# Altium project mod_duo_dwarf.PrjPcb (part 1 of 2)
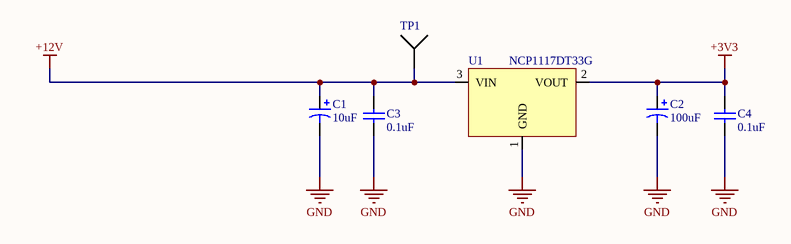
[diagram p0: [1]-PWR_12VIN.SchDoc]
6 sheets, 179 parts. Net scope: flat (ports and power ports of the same name join across sheets).
Board file: mod_duo_dwarf.PcbDoc
Sheets:
  [1]-PWR_12VIN.SchDoc
  [2]-MCU_LPC1778FBD144.SchDoc
  [3]-GLCD_128X64.SchDoc
  [4]-MECH_BUTTONS.SchDoc
  [5]-BUTTONS_ILLUMINATION.SchDoc
  [6]-PEAKMETER_LEDS.SchDoc

## Sheet [1]-PWR_12VIN.SchDoc: [1]-PWR_12VIN
size A3; DocumentNumber: 1; Revision: 01-01-2020; SheetNumber: 1; SheetTotal: 6

### Parts
C1  10uF  [CAP_EEE_C-L]
C2  100uF  [CAPAE6553X55M]
C3  0.1uF  [CAPC1608N]
C4  0.1uF  [CAPC1608N]
TP1  TP_1_MM  [TP_1_MM]  (value not drawn)  (no BOM)
U1  NCP1117DT33G  [DPAK-L]

### Nets
+3V3: C2.1 C4.2 U1.2(VOUT)
+12V: C1.2 C3.2 TP1.1 U1.3(VIN)
GND: C1.1 C2.2 C3.1 C4.1 U1.1(GND)

### Library data of the parts
C1 = EEE-1EA100SR: CAP ALUM 10UF 20% 25V SMD; Manufacturer 1: Panasonic; Ripple Current: 28mA; Life (Hours): 2000Hour; Leakage Current: 3uA; Lead Length: 2.2mm; Supplier 1: Digi-Key; Manufacturer Part Number 1: EEE-1EA100SR; Stock 1: 6724; Pricing 1: 1=0.31, 10=0.214, 100=0.1286, 500=0.09646 (USD); Mount: PCB,Surface Mount; Case/Package: Radial; Number of Pins: 2; Contact Plating: Tin; Min Operating Temperature: -40°C; Max Operating Temperature: 85°C; Capacitance: 10uF; Tolerance: 20%; Packaging: Tape and Reel; Voltage Rating: 25V; Ripple Current (AC): 28mA; Voltage Rating (DC): 25V; Package Quantity: 1; Termination: SMD/SMT; Voltage: 25V; Diameter: 5mm; Length: 5.5mm; Height: 5.4mm; Height - Seated (Max): 0.213inch; Width: 5.3mm; Lead Pitch: 1.5mm; Radiation Hardening: No; REACH SVHC: No SVHC; Supplier Part Number 1: PCE3894CT-ND
C2 = EEE-1AA101WR: CAP ALUM 100UF 20% 10V SMD; Manufacturer 1: Panasonic ECG; Description 1: Cap Aluminum Lytic 100uF 10V 20% (5 X 5.4mm) SMD 50mA 1000h 85C Automotive T/R; Ripple Current: 50mA; Life (Hours): 1000Hour; Supplier 1: Digi-Key; Manufacturer Part Number 1: EEE-1AA101WR; Stock 1: 122621; Pricing 1: 1=0.31, 10=0.212, 100=0.1272, 500=0.0954 (USD); Mount: Surface Mount,PCB; Case/Package: Radial; Contact Plating: Tin; Min Operating Temperature: -40°C; Max Operating Temperature: 85°C; Capacitance: 100uF; Tolerance: 20%; Voltage Rating: 10V; Packaging: Tape and Reel; Package Quantity: 1; Voltage Rating (DC): 10V; Termination: SMD/SMT; Ripple Current (AC): 50mA; Diameter: 5mm; Length: 5.5mm; Height: 5.4mm; Height - Seated (Max): 0.213inch; Radiation Hardening: No; Lead Free: Lead Free; REACH SVHC: Unknown; ComponentLink1URL: https://datasheet.ciiva.com/26945/getdatasheetpartid-169213-26945071.pdf; ComponentLink1Description: https://datasheet.ciiva.com/26945/getdatasheetpartid-169213-26945071.pdf; ComponentLink2URL: https://datasheet.ciiva.com/2983/aba0000ce2-2983906.pdf; ComponentLink2Description: https://datasheet.ciiva.com/2983/aba0000ce2-2983906.pdf; ComponentLink3URL: https://datasheet.ciiva.com/24027/aba0000ce2-40801-24027541.pdf; ComponentLink3Description: https://datasheet.ciiva.com/24027/aba0000ce2-40801-24027541.pdf; ComponentLink4URL: https://datasheet.ciiva.com/30075/11aba0000ce2-30075303.pdf; ComponentLink4Description: https://datasheet.ciiva.com/30075/11aba0000ce2-30075303.pdf; ComponentLink5URL: https://datasheet.ciiva.com/16427/aba0000ce2-16427544.pdf; ComponentLink5Description: https://datasheet.ciiva.com/16427/aba0000ce2-16427544.pdf; ComponentLink6URL: https://datasheet.ciiva.com/14598/70255710-14598233.pdf; ComponentLink6Description: https://datasheet.ciiva.com/14598/70255710-14598233.pdf; ComponentLink7URL: https://datasheet.ciiva.com/14605/70255710-14605689.pdf; ComponentLink7Description: https://datasheet.ciiva.com/14605/70255710-14605689.pdf; ComponentLink8URL: https://datasheet.ciiva.com/11673/aba0000ce2-11673882.pdf; ComponentLink8Description: https://datasheet.ciiva.com/11673/aba0000ce2-11673882.pdf; Supplier Part Number 1: PCE3867CT-ND
C3 C4 = CC0603KRX7R8BB104: CAP CER 0.1UF 25V X7R 0603; Manufacturer 1: Yageo; Capacitance: 100nF; Tolerance: 10%; Supplier 1: Digi-Key; Manufacturer Part Number 1: CC0603KRX7R8BB104; Stock 1: 40000; Pricing 1: 1=0.1, 10=0.074, 100=0.0329, 500=0.02352, 1000=0.01848 (USD); Mount: Surface Mount; Case/Package: 0603; Number of Pins: 2; Case Code (Imperial): 0603; Case Code (Metric): 1608; Min Operating Temperature: -55°C; Max Operating Temperature: 125°C; Dielectric: X7R; Voltage Rating: 25V; Packaging: Tape and Reel; Package Quantity: 1; Voltage Rating (DC): 25V; Termination: SMD/SMT; Composition: Ceramic; Voltage: 25V; Length: 1.6mm; Height: 0.8mm; Width: 0.8mm; Thickness: 0.035inch; Depth: 0.8mm; Radiation Hardening: No; REACH SVHC: Unknown; Lead Free: Lead Free; Halogen Free: Halogen Free; ComponentLink1URL: https://datasheet.ciiva.com/11786/0900766b80c10176-11786120.pdf; ComponentLink1Description: https://datasheet.ciiva.com/11786/0900766b80c10176-11786120.pdf; ComponentLink2URL: https://datasheet.ciiva.com/144/mlccorderingcode-144075.pdf; ComponentLink2Description: https://datasheet.ciiva.com/144/mlccorderingcode-144075.pdf; ComponentLink3URL: https://datasheet.ciiva.com/17434/upy-gphc-x7r-6-3v-to-50v-8-17434263.pdf; ComponentLink3Description: https://datasheet.ciiva.com/17434/upy-gphc-x7r-6-3v-to-50v-8-17434263.pdf; ComponentLink4URL: https://datasheet.ciiva.com/26829/getdatasheetpartid-403577-26829431.pdf; ComponentLink4Description: https://datasheet.ciiva.com/26829/getdatasheetpartid-403577-26829431.pdf; ComponentLink5URL: https://datasheet.ciiva.com/11587/upy-gphc-x7r-6-3v-to-50v-8-11587208.pdf; ComponentLink5Description: https://datasheet.ciiva.com/11587/upy-gphc-x7r-6-3v-to-50v-8-11587208.pdf; ComponentLink6URL: https://datasheet.ciiva.com/13389/upy-gphc-x7r-6-3v-to-50v-8-13389352.pdf; ComponentLink6Description: https://datasheet.ciiva.com/13389/upy-gphc-x7r-6-3v-to-50v-8-13389352.pdf; ComponentLink7URL: https://datasheet.ciiva.com/28450/1489800-28450584.pdf; ComponentLink7Description: https://datasheet.ciiva.com/28450/1489800-28450584.pdf; ComponentLink8URL: https://datasheet.ciiva.com/144/mlccorderingcode-144073.pdf; ComponentLink8Description: https://datasheet.ciiva.com/144/mlccorderingcode-144073.pdf; ComponentLink9URL: https://datasheet.ciiva.com/144/mlccorderingcode-144074.pdf; ComponentLink9Description: https://datasheet.ciiva.com/144/mlccorderingcode-144074.pdf; ComponentLink10URL: https://datasheet.ciiva.com/7978/1489800-7978155.pdf; ComponentLink10Description: https://datasheet.ciiva.com/7978/1489800-7978155.pdf; Supplier Part Number 1: 311-1341-1-ND
U1 = IC_NCP1117DT33G: IC REG LDO 3.3V 1A DPAK; Manufacturer 1: ON Semiconductor; Dropout Voltage: 1.07V; Max Input Voltage: 20V; Number of Outputs: 1; Input Bias Current: 6mA; Polarity: Positive; Accuracy: 1%; Output Type: Fixed; Supplier 1: Digi-Key; Manufacturer Part Number 1: NCP1117DT33G; Stock 1: 3065; Pricing 1: 1=0.44, 75=0.3504, 150=0.28027, 525=0.22023, 1050=0.17017 (USD); Mount: Surface Mount; Case/Package: DPAK; Number of Pins: 3; Contact Plating: Matte,Tin; Min Operating Temperature: 0°C; Max Operating Temperature: 125°C; Output Current: 1A; Max Output Current: 1A; Output Voltage: 3.3V; Package Quantity: 75; Packaging: Rail/Tube; Nominal Output Voltage: 3.3V; Number of Regulators: 1; Min Current Limit: 1A; Quiescent Current: 6mA; Min Output Voltage: 3.3V; Output Voltage Accuracy: 1%; Length: 6.73mm; Height: 2.38mm; Width: 6.22mm; Radiation Hardening: No; REACH SVHC: No SVHC; Lead Free: Lead Free; Halogen Free: Halogen Free; Supplier Part Number 1: NCP1117DT33GOS-ND

## Sheet [2]-MCU_LPC1778FBD144.SchDoc: [2]-MCU_LPC1778FBD144
size A2; DocumentNumber: 2; Revision: 01-01-2020; SheetNumber: 2; SheetTotal: 6
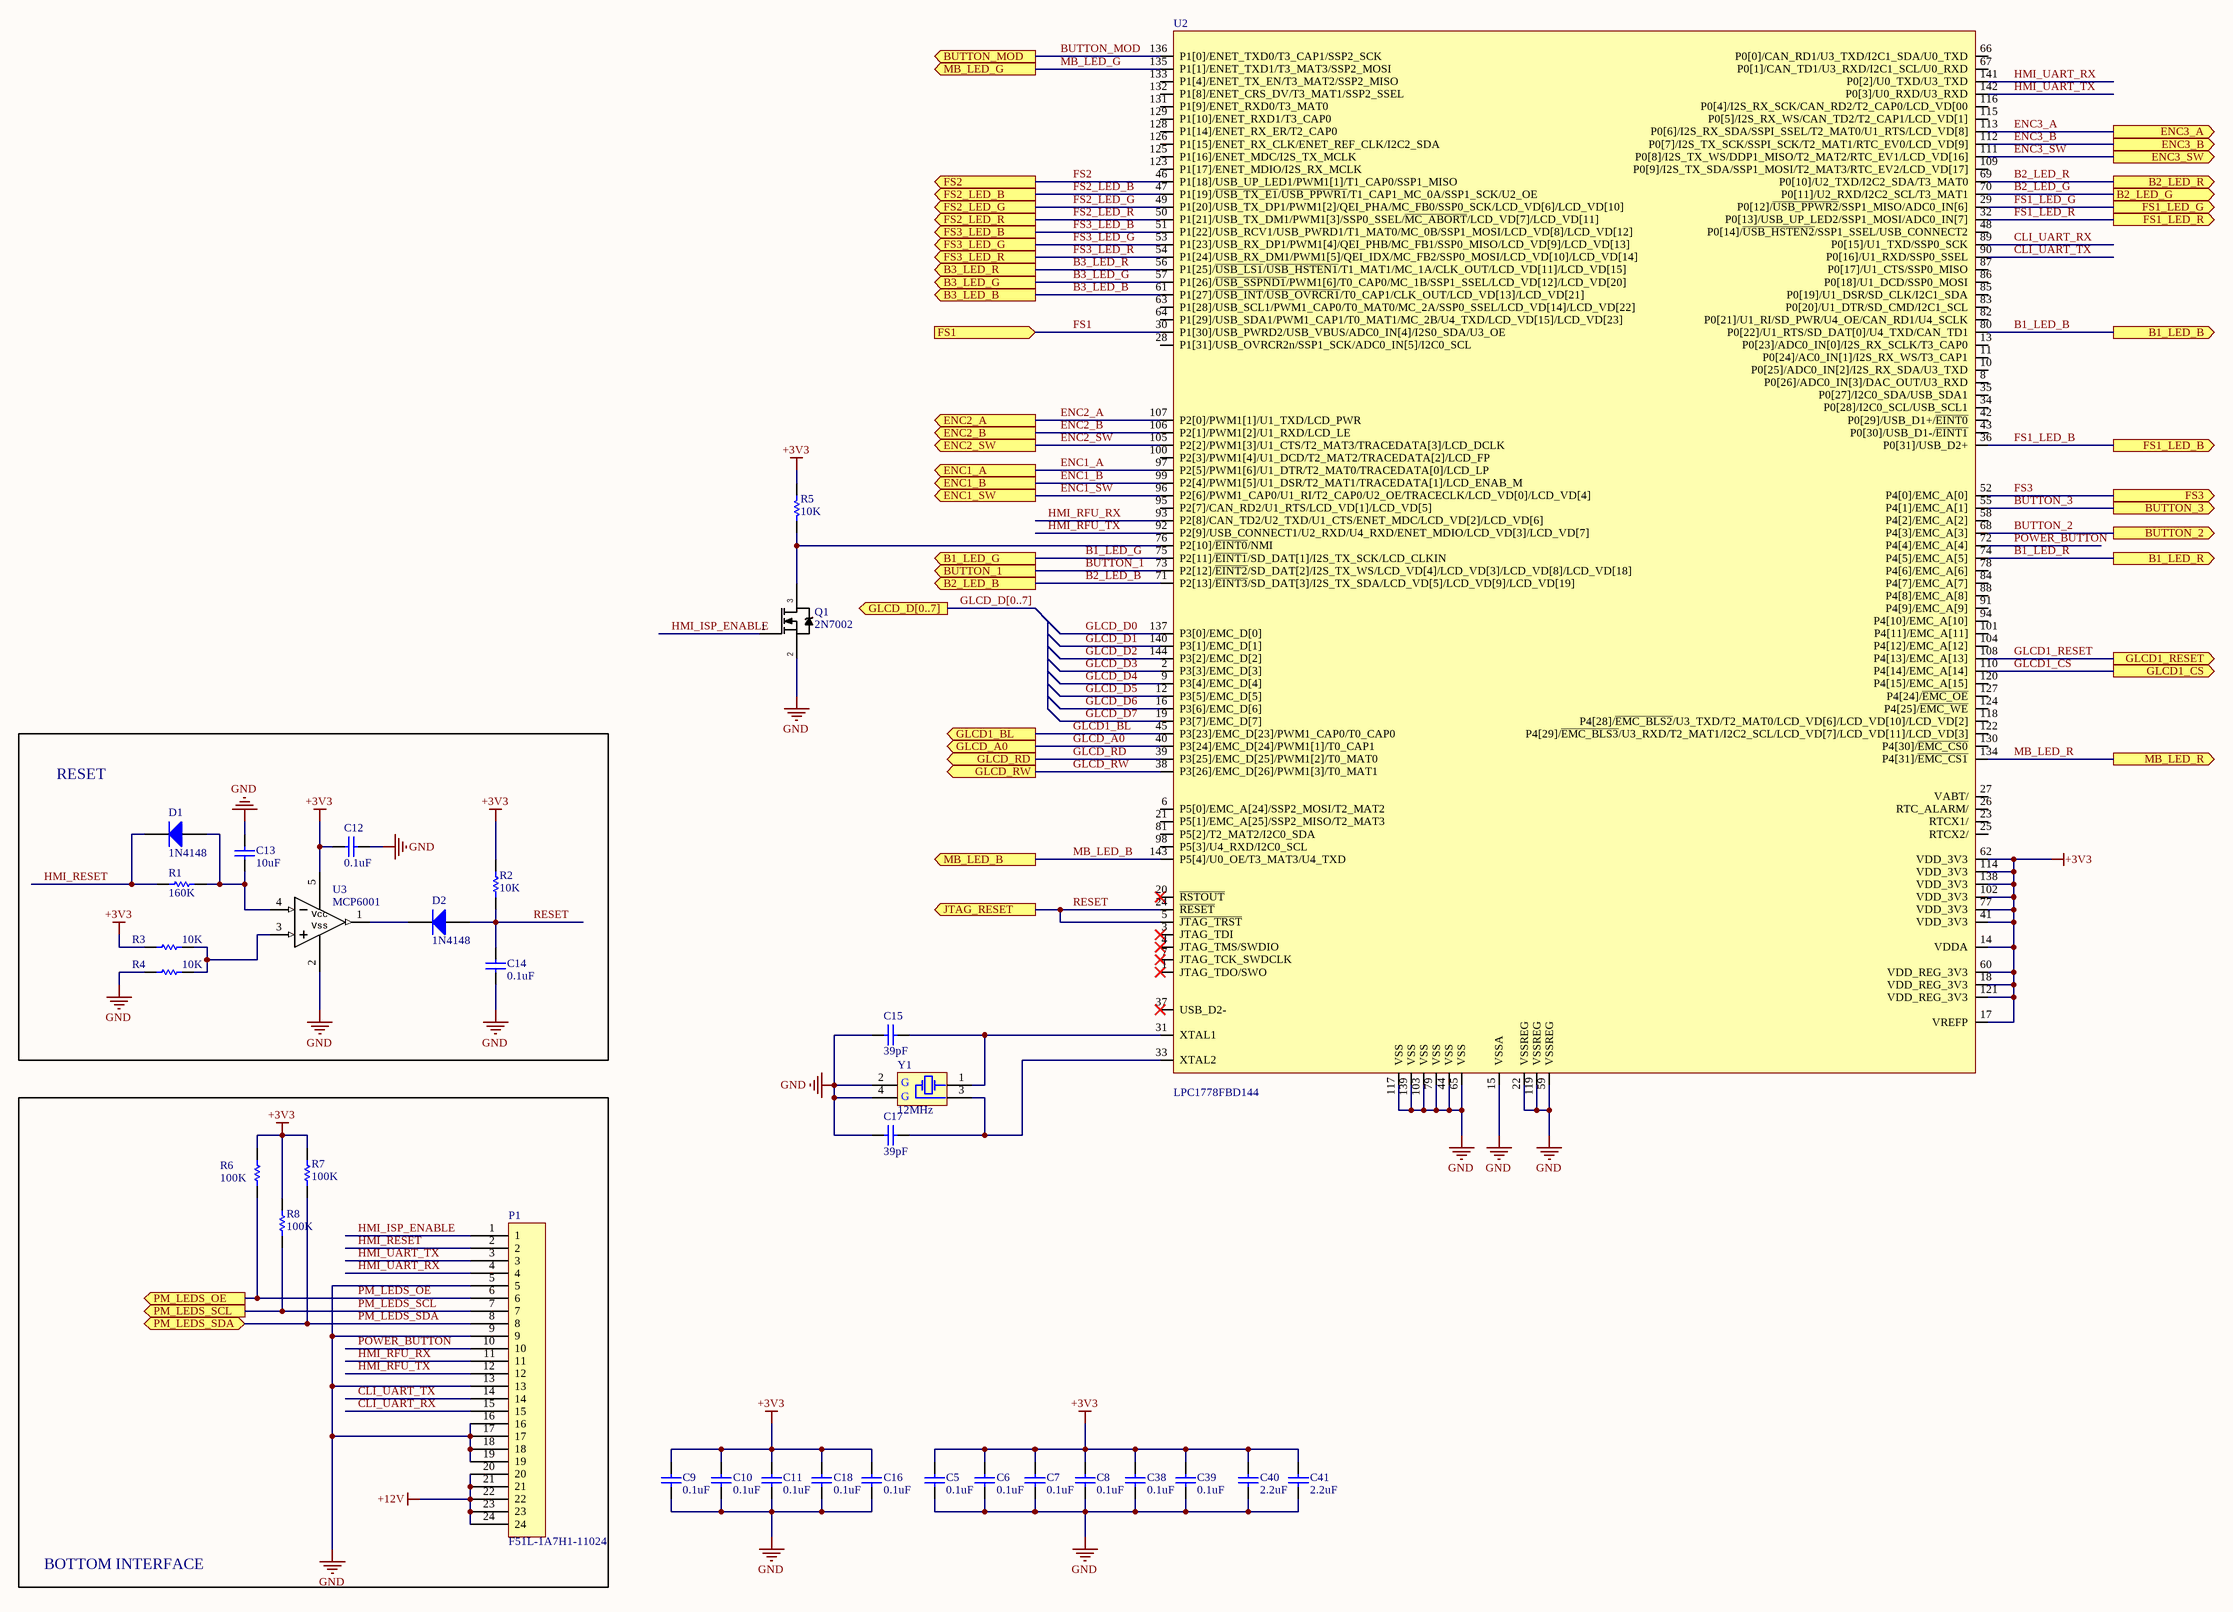
[diagram p1: [2]-MCU_LPC1778FBD144.SchDoc]

### Parts
C5  0.1uF  [CAPC1608N]
C6  0.1uF  [CAPC1608N]
C7  0.1uF  [CAPC1608N]
C8  0.1uF  [CAPC1608N]
C9  0.1uF  [CAPC1608N]
C10  0.1uF  [CAPC1608N]
C11  0.1uF  [CAPC1608N]
C12  0.1uF  [CAPC1608N]
C13  10uF  [CAPC1608N]
C14  0.1uF  [CAPC1608N]
C15  39pF  [CAPC1608N]
C16  0.1uF  [CAPC1608N]
C17  39pF  [CAPC1608N]
C18  0.1uF  [CAPC1608N]
C38  0.1uF  [CAPC1608N]
C39  0.1uF  [CAPC1608N]
C40  2.2uF  [CAPC1608N]
C41  2.2uF  [CAPC1608N]
D1  1N4148  [SOD-323]
D2  1N4148  [SOD-323]
P1  F51L-1A7H1-11024  [F51L-1A7H1-11024]
Q1  2N7002  [SOT23-3N]
R1  160K  [RESC1608N]
R2  10K  [RESC1608N]
R3  10K  [RESC1608N]
R4  10K  [RESC1608N]
R5  10K  [RESC1608N]
R6  100K  [RESC1608N]
R7  100K  [RESC1608N]
R8  100K  [RESC1608N]
U2  LPC1778FBD144  [LQFP144-SOT486-1]
U3  MCP6001  [SOT23-5N]
Y1  12MHz  [ECS-120-20-30B-AGL-TR]

### Blocks framed on the sheet
RESET: C12-C14 D1 D2 R1-R4 U3
BOTTOM INTERFACE: P1 R6-R8

### Ports
B1_LED_B (out), B1_LED_G (out), B1_LED_R (out), B2_LED_B (out), B2_LED_G (out), B2_LED_R (out), B3_LED_B (out), B3_LED_G (out), B3_LED_R (out), BUTTON_1 (out), BUTTON_2 (out), BUTTON_3 (out), BUTTON_MOD (out), ENC1_A (out), ENC1_B (out), ENC1_SW (out), ENC2_A (out), ENC2_B (out), ENC2_SW (out), ENC3_A (out), ENC3_B (out), ENC3_SW (out), FS1 (in), FS1_LED_B (out), FS1_LED_G (out), FS1_LED_R (out), FS2 (out), FS2_LED_B (out), FS2_LED_G (out), FS2_LED_R (out), FS3 (out), FS3_LED_B (out), FS3_LED_G (out), FS3_LED_R (out), GLCD1_BL (out), GLCD1_CS (out), GLCD1_RESET (out), GLCD_A0 (out), GLCD_D[0..7] (out), GLCD_RD (out), GLCD_RW (out), JTAG_RESET (out), MB_LED_B (out), MB_LED_G (out), MB_LED_R (out), PM_LEDS_OE (out), PM_LEDS_SCL (out), PM_LEDS_SDA (bidir)

### Nets
+3V3: C5.2 C6.2 C7.2 C8.2 C9.2 C10.2 C11.2 C12.2 C16.2 C18.2 C38.2 C39.2 C40.2 C41.2 R2.1 R3.2 R5.1 R6.2 R7.2 R8.2 U2.14(VDDA) U2.17(VREFP) U2.18(VDD_REG_3V3) U2.41(VDD_3V3) U2.60(VDD_REG_3V3) U2.62(VDD_3V3) U2.77(VDD_3V3) U2.102(VDD_3V3) U2.114(VDD_3V3) U2.121(VDD_REG_3V3) U2.138(VDD_3V3) U3.5(VCC)
+12V: P1.20 P1.21 P1.22 P1.23 P1.24
GND: C5.1 C6.1 C7.1 C8.1 C9.1 C10.1 C11.1 C12.1 C13.1 C14.2 C15.2 C16.1 C17.1 C18.1 C38.1 C39.1 C40.1 C41.1 P1.5 P1.9 P1.13 P1.16 P1.17 P1.18 P1.19 Q1.2(S) R4.2 U2.15(VSSA) U2.22(VSSREG) U2.44(VSS) U2.59(VSSREG) U2.65(VSS) U2.79(VSS) U2.103(VSS) U2.117(VSS) U2.119(VSSREG) U2.139(VSS) U3.2(VSS) Y1.2(G) Y1.4(G)
B1_LED_B: U2.80(P0[22]/U1_RTS/SD_DAT[0]/U4_TXD/CAN_TD1) ; port B1_LED_B
B1_LED_G: U2.75(P2[11]/~{EINT1}/SD_DAT[1]/I2S_TX_SCK/LCD_CLKIN) ; port B1_LED_G
B1_LED_R: U2.74(P4[5]/EMC_A[5]) ; port B1_LED_R
B2_LED_B: U2.71(P2[13]/~{EINT3}/SD_DAT[3]/I2S_TX_SDA/LCD_VD[5]/LCD_VD[9]/LCD_VD[19]) ; port B2_LED_B
B2_LED_G: U2.70(P0[11]/U2_RXD/I2C2_SCL/T3_MAT1) ; port B2_LED_G
B2_LED_R: U2.69(P0[10]/U2_TXD/I2C2_SDA/T3_MAT0) ; port B2_LED_R
B3_LED_B: U2.61(P1[27]/~{USB_INT}/~{USB_OVRCR1}/T0_CAP1/CLK_OUT/LCD_VD[13]/LCD_VD[21]) ; port B3_LED_B
B3_LED_G: U2.57(P1[26]/~{USB_SSPND1}/PWM1[6]/T0_CAP0/MC_1B/SSP1_SSEL/LCD_VD[12]/LCD_VD[20]) ; port B3_LED_G
B3_LED_R: U2.56(P1[25]/~{USB_LS1}/~{USB_HSTEN1}/T1_MAT1/MC_1A/CLK_OUT/LCD_VD[11]/LCD_VD[15]) ; port B3_LED_R
BUTTON_1: U2.73(P2[12]/~{EINT2}/SD_DAT[2]/I2S_TX_WS/LCD_VD[4]/LCD_VD[3]/LCD_VD[8]/LCD_VD[18]) ; port BUTTON_1
BUTTON_2: U2.68(P4[3]/EMC_A[3]) ; port BUTTON_2
BUTTON_3: U2.55(P4[1]/EMC_A[1]) ; port BUTTON_3
BUTTON_MOD: U2.136(P1[0]/ENET_TXD0/T3_CAP1/SSP2_SCK) ; port BUTTON_MOD
CLI_UART_RX: P1.15 U2.89(P0[15]/U1_TXD/SSP0_SCK)
CLI_UART_TX: P1.14 U2.90(P0[16]/U1_RXD/SSP0_SSEL)
ENC1_A: U2.97(P2[5]/PWM1[6]/U1_DTR/T2_MAT0/TRACEDATA[0]/LCD_LP) ; port ENC1_A
ENC1_B: U2.99(P2[4]/PWM1[5]/U1_DSR/T2_MAT1/TRACEDATA[1]/LCD_ENAB_M) ; port ENC1_B
ENC1_SW: U2.96(P2[6]/PWM1_CAP0/U1_RI/T2_CAP0/U2_OE/TRACECLK/LCD_VD[0]/LCD_VD[4]) ; port ENC1_SW
ENC2_A: U2.107(P2[0]/PWM1[1]/U1_TXD/LCD_PWR) ; port ENC2_A
ENC2_B: U2.106(P2[1]/PWM1[2]/U1_RXD/LCD_LE) ; port ENC2_B
ENC2_SW: U2.105(P2[2]/PWM1[3]/U1_CTS/T2_MAT3/TRACEDATA[3]/LCD_DCLK) ; port ENC2_SW
ENC3_A: U2.113(P0[6]/I2S_RX_SDA/SSPI_SSEL/T2_MAT0/U1_RTS/LCD_VD[8]) ; port ENC3_A
ENC3_B: U2.112(P0[7]/I2S_TX_SCK/SSPI_SCK/T2_MAT1/RTC_EV0/LCD_VD[9]) ; port ENC3_B
ENC3_SW: U2.111(P0[8]/I2S_TX_WS/DDP1_MISO/T2_MAT2/RTC_EV1/LCD_VD[16]) ; port ENC3_SW
FS1: U2.30(P1[30]/USB_PWRD2/USB_VBUS/ADC0_IN[4]/I2S0_SDA/U3_OE) ; port FS1
FS1_LED_B: U2.36(P0[31]/USB_D2+) ; port FS1_LED_B
FS1_LED_G: U2.29(P0[12]/~{USB_PPWR2}/SSP1_MISO/ADC0_IN[6]) ; port FS1_LED_G
FS1_LED_R: U2.32(P0[13]/USB_UP_LED2/SSP1_MOSI/ADC0_IN[7]) ; port FS1_LED_R
FS2: U2.46(P1[18]/USB_UP_LED1/PWM1[1]/T1_CAP0/SSP1_MISO) ; port FS2
FS2_LED_B: U2.47(P1[19]/~{USB_TX_E1}/~{USB_PPWR1}/T1_CAP1_MC_0A/SSP1_SCK/U2_OE) ; port FS2_LED_B
FS2_LED_G: U2.49(P1[20]/USB_TX_DP1/PWM1[2]/QEI_PHA/MC_FB0/SSP0_SCK/LCD_VD[6]/LCD_VD[10]) ; port FS2_LED_G
FS2_LED_R: U2.50(P1[21]/USB_TX_DM1/PWM1[3]/SSP0_SSEL/~{MC_ABORT}/LCD_VD[7]/LCD_VD[11]) ; port FS2_LED_R
FS3: U2.52(P4[0]/EMC_A[0]) ; port FS3
FS3_LED_B: U2.51(P1[22]/USB_RCV1/USB_PWRD1/T1_MAT0/MC_0B/SSP1_MOSI/LCD_VD[8]/LCD_VD[12]) ; port FS3_LED_B
FS3_LED_G: U2.53(P1[23]/USB_RX_DP1/PWM1[4]/QEI_PHB/MC_FB1/SSP0_MISO/LCD_VD[9]/LCD_VD[13]) ; port FS3_LED_G
FS3_LED_R: U2.54(P1[24]/USB_RX_DM1/PWM1[5]/QEI_IDX/MC_FB2/SSP0_MOSI/LCD_VD[10]/LCD_VD[14]) ; port FS3_LED_R
GLCD1_BL: U2.45(P3[23]/EMC_D[23]/PWM1_CAP0/T0_CAP0) ; port GLCD1_BL
GLCD1_CS: U2.110(P4[14]/EMC_A[14]) ; port GLCD1_CS
GLCD1_RESET: U2.108(P4[13]/EMC_A[13]) ; port GLCD1_RESET
GLCD_A0: U2.40(P3[24]/EMC_D[24]/PWM1[1]/T0_CAP1) ; port GLCD_A0
GLCD_D0: U2.137(P3[0]/EMC_D[0])
GLCD_D1: U2.140(P3[1]/EMC_D[1])
GLCD_D2: U2.144(P3[2]/EMC_D[2])
GLCD_D3: U2.2(P3[3]/EMC_D[3])
GLCD_D4: U2.9(P3[4]/EMC_D[4])
GLCD_D5: U2.12(P3[5]/EMC_D[5])
GLCD_D6: U2.16(P3[6]/EMC_D[6])
GLCD_D7: U2.19(P3[7]/EMC_D[7])
GLCD_RD: U2.39(P3[25]/EMC_D[25]/PWM1[2]/T0_MAT0) ; port GLCD_RD
GLCD_RW: U2.38(P3[26]/EMC_D[26]/PWM1[3]/T0_MAT1) ; port GLCD_RW
HMI_ISP_ENABLE: P1.1 Q1.1(G)
HMI_RESET: D1.1(K) P1.2 R1.1
HMI_RFU_RX: P1.11 U2.93(P2[8]/CAN_TD2/U2_TXD/U1_CTS/ENET_MDC/LCD_VD[2]/LCD_VD[6])
HMI_RFU_TX: P1.12 U2.92(P2[9]/USB_CONNECT1/U2_RXD/U4_RXD/ENET_MDIO/LCD_VD[3]/LCD_VD[7])
HMI_UART_RX: P1.4 U2.141(P0[2]/U0_TXD/U3_TXD)
HMI_UART_TX: P1.3 U2.142(P0[3]/U0_RXD/U3_RXD)
MB_LED_B: U2.143(P5[4]/U0_OE/T3_MAT3/U4_TXD) ; port MB_LED_B
MB_LED_G: U2.135(P1[1]/ENET_TXD1/T3_MAT3/SSP2_MOSI) ; port MB_LED_G
MB_LED_R: U2.134(P4[31]/~{EMC_CS1}) ; port MB_LED_R
PM_LEDS_OE: P1.6 R6.1 ; port PM_LEDS_OE
PM_LEDS_SCL: P1.7 R8.1 ; port PM_LEDS_SCL
PM_LEDS_SDA: P1.8 R7.1 ; port PM_LEDS_SDA
POWER_BUTTON: P1.10 U2.72(P4[4]/EMC_A[4])
RESET: C14.1 D2.2(A) R2.2 U2.5(~{JTAG_TRST}) U2.24(~{RESET}) ; port JTAG_RESET
NetC13_2: C13.2 D1.2(A) R1.2 U3.4(IN-)
NetC15_1: C15.1 U2.31(XTAL1) Y1.1(OSC1)
NetC17_2: C17.2 U2.33(XTAL2) Y1.3(OSC2)
NetD2_1: D2.1(K) U3.1(OUT)
NetQ1_3: Q1.3(D) R5.2 U2.76(P2[10]/~{EINT0}/NMI)
NetR3_1: R3.1 R4.1 U3.3(IN+)

Not connected (* = marked no-connect by the designer): U2 1(JTAG_TDO/SWO)* 3(JTAG_TDI)* 4(JTAG_TMS/SWDIO)* 6(P5[0]/EMC_A[24]/SSP2_MOSI/T2_MAT2) 7(JTAG_TCK_SWDCLK)* 8(P0[26]/ADC0_IN[3]/DAC_OUT/U3_RXD) 10(P0[25]/ADC0_IN[2]/I2S_RX_SDA/U3_TXD) 11(P0[24]/AC0_IN[1]/I2S_RX_WS/T3_CAP1) 13(P0[23]/ADC0_IN[0]/I2S_RX_SCLK/T3_CAP0) 20(~{RSTOUT})* 21(P5[1]/EMC_A[25]/SSP2_MISO/T2_MAT3) 23(RTCX1/) 25(RTCX2/) 26(RTC_ALARM/) 27(VABT/) 28(P1[31]/USB_OVRCR2n/SSP1_SCK/ADC0_IN[5]/I2C0_SCL) 34(P0[28]/I2C0_SCL/USB_SCL1) 35(P0[27]/I2C0_SDA/USB_SDA1) 37(USB_D2-)* 42(P0[29]/USB_D1+/~{EINT0}) 43(P0[30]/USB_D1-/~{EINT1}) 48(P0[14]/~{USB_HSTEN2}/SSP1_SSEL/USB_CONNECT2) 58(P4[2]/EMC_A[2]) 63(P1[28]/USB_SCL1/PWM1_CAP0/T0_MAT0/MC_2A/SSP0_SSEL/LCD_VD[14]/LCD_VD[22]) 64(P1[29]/USB_SDA1/PWM1_CAP1/T0_MAT1/MC_2B/U4_TXD/LCD_VD[15]/LCD_VD[23]) 66(P0[0]/CAN_RD1/U3_TXD/I2C1_SDA/U0_TXD) 67(P0[1]/CAN_TD1/U3_RXD/I2C1_SCL/U0_RXD) 78(P4[6]/EMC_A[6]) 81(P5[2]/T2_MAT2/I2C0_SDA) 82(P0[21]/U1_RI/SD_PWR/U4_OE/CAN_RD1/U4_SCLK) 83(P0[20]/U1_DTR/SD_CMD/I2C1_SCL) 84(P4[7]/EMC_A[7]) 85(P0[19]/U1_DSR/SD_CLK/I2C1_SDA) 86(P0[18]/U1_DCD/SSP0_MOSI) 87(P0[17]/U1_CTS/SSP0_MISO) 88(P4[8]/EMC_A[8]) 91(P4[9]/EMC_A[9]) 94(P4[10]/EMC_A[10]) 95(P2[7]/CAN_RD2/U1_RTS/LCD_VD[1]/LCD_VD[5]) 98(P5[3]/U4_RXD/I2C0_SCL) 100(P2[3]/PWM1[4]/U1_DCD/T2_MAT2/TRACEDATA[2]/LCD_FP) 101(P4[11]/EMC_A[11]) 104(P4[12]/EMC_A[12]) 109(P0[9]/I2S_TX_SDA/SSP1_MOSI/T2_MAT3/RTC_EV2/LCD_VD[17]) 115(P0[5]/I2S_RX_WS/CAN_TD2/T2_CAP1/LCD_VD[1]) 116(P0[4]/I2S_RX_SCK/CAN_RD2/T2_CAP0/LCD_VD[00) 118(P4[28]/~{EMC_BLS2}/U3_TXD/T2_MAT0/LCD_VD[6]/LCD_VD[10]/LCD_VD[2]) 120(P4[15]/EMC_A[15]) 122(P4[29]/~{EMC_BLS3}/U3_RXD/T2_MAT1/I2C2_SCL/LCD_VD[7]/LCD_VD[11]/LCD_VD[3]) 123(P1[17]/ENET_MDIO/I2S_RX_MCLK) 124(P4[25]/~{EMC_WE}) 125(P1[16]/ENET_MDC/I2S_TX_MCLK) 126(P1[15]/ENET_RX_CLK/ENET_REF_CLK/I2C2_SDA) 127(P4[24]/~{EMC_OE}) 128(P1[14]/ENET_RX_ER/T2_CAP0) 129(P1[10]/ENET_RXD1/T3_CAP0) 130(P4[30]/~{EMC_CS0}) 131(P1[9]/ENET_RXD0/T3_MAT0) 132(P1[8]/ENET_CRS_DV/T3_MAT1/SSP2_SSEL) 133(P1[4]/ENET_TX_EN/T3_MAT2/SSP2_MISO)

### Buses and harness runs
bus GLCD_D[0..7] = port GLCD_D[0..7]

### Notes on the sheet
- (in symbol IC_MCP6001T-I/OT) Vcc; Vss

### Library data of the parts
C5-C12 C14 C16 C18 C38 C39 = CC0603KRX7R8BB104: as C3 on sheet [1]-PWR_12VIN; Supplier 1: Digi-Key; Manufacturer Part Number 1: CC0603KRX7R8BB104; Stock 1: 40000; Pricing 1: 1=0.1, 10=0.074, 100=0.0329, 500=0.02352, 1000=0.01848 (USD); Mount: Surface Mount; Case/Package: 0603; Number of Pins: 2; Case Code (Imperial): 0603; Case Code (Metric): 1608; Min Operating Temperature: -55°C; Max Operating Temperature: 125°C; Dielectric: X7R; Voltage Rating: 25V; Packaging: Tape and Reel; Package Quantity: 1; Voltage Rating (DC): 25V; Termination: SMD/SMT; Composition: Ceramic; Voltage: 25V; Length: 1.6mm; Height: 0.8mm; Width: 0.8mm; Thickness: 0.035inch; Depth: 0.8mm; Radiation Hardening: No; REACH SVHC: Unknown; Lead Free: Lead Free; Halogen Free: Halogen Free; ComponentLink1URL: https://datasheet.ciiva.com/11786/0900766b80c10176-11786120.pdf; ComponentLink1Description: https://datasheet.ciiva.com/11786/0900766b80c10176-11786120.pdf; ComponentLink2URL: https://datasheet.ciiva.com/144/mlccorderingcode-144075.pdf; ComponentLink2Description: https://datasheet.ciiva.com/144/mlccorderingcode-144075.pdf; ComponentLink3URL: https://datasheet.ciiva.com/17434/upy-gphc-x7r-6-3v-to-50v-8-17434263.pdf; ComponentLink3Description: https://datasheet.ciiva.com/17434/upy-gphc-x7r-6-3v-to-50v-8-17434263.pdf; ComponentLink4URL: https://datasheet.ciiva.com/26829/getdatasheetpartid-403577-26829431.pdf; ComponentLink4Description: https://datasheet.ciiva.com/26829/getdatasheetpartid-403577-26829431.pdf; ComponentLink5URL: https://datasheet.ciiva.com/11587/upy-gphc-x7r-6-3v-to-50v-8-11587208.pdf; ComponentLink5Description: https://datasheet.ciiva.com/11587/upy-gphc-x7r-6-3v-to-50v-8-11587208.pdf; ComponentLink6URL: https://datasheet.ciiva.com/13389/upy-gphc-x7r-6-3v-to-50v-8-13389352.pdf; ComponentLink6Description: https://datasheet.ciiva.com/13389/upy-gphc-x7r-6-3v-to-50v-8-13389352.pdf; ComponentLink7URL: https://datasheet.ciiva.com/28450/1489800-28450584.pdf; ComponentLink7Description: https://datasheet.ciiva.com/28450/1489800-28450584.pdf; ComponentLink8URL: https://datasheet.ciiva.com/144/mlccorderingcode-144073.pdf; ComponentLink8Description: https://datasheet.ciiva.com/144/mlccorderingcode-144073.pdf; ComponentLink9URL: https://datasheet.ciiva.com/144/mlccorderingcode-144074.pdf; ComponentLink9Description: https://datasheet.ciiva.com/144/mlccorderingcode-144074.pdf; ComponentLink10URL: https://datasheet.ciiva.com/7978/1489800-7978155.pdf; ComponentLink10Description: https://datasheet.ciiva.com/7978/1489800-7978155.pdf; Supplier Part Number 1: 311-1341-1-ND
C13 = GRM188R61A106KE69D: CAP CER 10UF 10V X5R 0603; Manufacturer 1: Murata; Tolerance: 10%; Supplier 1: Digi-Key; Manufacturer Part Number 1: GRM188R61A106KE69D; Stock 1: 40000; Pricing 1: 1=0.22, 10=0.149, 100=0.0754, 500=0.05158, 1000=0.04563 (USD); Mount: Surface Mount; Case/Package: 0603; Case Code (Metric): 1608; Case Code (Imperial): 0603; Min Operating Temperature: -55°C; Max Operating Temperature: 85°C; Capacitance: 10uF; Packaging: Tape and Reel; Dielectric: X5R; Voltage Rating: 10V; Voltage: 10V; Voltage Rating (DC): 10V; Length: 1.6mm; Height: 0.8mm; Width: 0.031inch; Thickness: 0.037inch; Depth: 0.8mm; REACH SVHC: No SVHC; Lead Free: Lead Free; Supplier Part Number 1: 490-10474-1-ND
C15 C17 = C1608NP01H390J080AA: CAP CER 39PF 50V NP0 0603; Manufacturer 1: TDK; Tolerance: 5%; Dielectric: C0G; Supplier 1: Digi-Key; Manufacturer Part Number 1: C1608NP01H390J080AA; Stock 1: 1503; Pricing 1: 1=0.15, 10=0.106, 100=0.05, 500=0.03508, 1000=0.02904 (USD); Mount: Surface Mount; Case/Package: 0603; Weight: 7.1E-05oz; Case Code (Metric): 1608; Case Code (Imperial): 0603; Min Operating Temperature: -55°C; Max Operating Temperature: 150°C; Package Quantity: 4000; Packaging: Tape and Reel; Capacitance: 39pF; Voltage Rating: 50V; Termination: SMD/SMT; Voltage Rating (DC): 50V; Length: 0.063inch; Height: 0.8mm; Width: 0.031inch; Thickness: 0.035inch; Supplier Part Number 1: 445-14077-1-ND
C40 C41 = CL10A225KP8NNNC: CAP CER 2.2UF 10V X5R 0603; Manufacturer 1: Samsung; Material: Ceramic; Tolerance: 10%; Supplier 1: Digi-Key; Manufacturer Part Number: CL10A225KP8NNNC; Stock 1: 320107; Pricing 1: 1=0.10000, 10=0.07600, 100=0.03400, 500=0.02426, 1000=0.01906 (USD); RoHS: Yes; Mount: Surface Mount; Case/Package: 0603; Case Code (Metric): 1608; Case Code (Imperial): 0603; Min Operating Temperature: -55°C; Max Operating Temperature: 85°C; Capacitance: 2.2uF; Dielectric: X5R; Package Quantity: 1; Packaging: Tape and Reel; Voltage Rating: 10V; Voltage: 10V; Voltage Rating (DC): 10V; Length: 1.6mm; Height: 0.8mm; Width: 0.031inch; Thickness: 0.035inch; Depth: 0.8mm; Radiation Hardening: No; Lead Free: Lead Free; ComponentLink1URL: https://datasheet.ciiva.com/25799/cl10a225kp8nnnc-25799697.pdf?src-supplier=Digi-Key; ComponentLink1Description: https://datasheet.ciiva.com/25799/cl10a225kp8nnnc-25799697.pdf?src-supplier=Digi-Key; ComponentLink2URL: https://datasheet.ciiva.com/26838/getdatasheetpartid-358617-26838359.pdf?src-supplier=Verical; ComponentLink2Description: https://datasheet.ciiva.com/26838/getdatasheetpartid-358617-26838359.pdf?src-supplier=Verical; ComponentLink3URL: https://datasheet.ciiva.com/29198/457945-da-01-en-vs-kondensator-0603-29198592.pdf?src-supplier=Conrad; ComponentLink3Description: https://datasheet.ciiva.com/29198/457945-da-01-en-vs-kondensator-0603-29198592.pdf?src-supplier=Conrad; Supplier Part Number 1: 1276-1085-1-ND
D1 D2 = 1N4148WS-7-F: DIODE SWITCHING 75V 0.15A SOD323; Manufacturer 1: Diodes; Forward Current: 300mA; Reverse Recovery Time: 4ns; Element Configuration: Single; Forward Voltage: 1.25V; Peak Reverse Current: 1uA; Peak Non-Repetitive Surge Current: 2A; Average Rectified Current: 150mA; Power Dissipation: 200mW; Polarity: Standard; Capacitance: 2pF; Supplier 1: Digi-Key; Manufacturer Part Number 1: 1N4148WS-7-F; Stock 1: 557451; Pricing 1: 1=0.19, 10=0.171, 100=0.0932, 500=0.05736, 1000=0.03911 (USD); Mount: Surface Mount; Number of Pins: 2; Weight: 0.000173oz; Contact Plating: Tin,Matte; Min Operating Temperature: -65°C; Max Operating Temperature: 150°C; Max Repetitive Reverse Voltage (Vrrm): 75V; Max Forward Surge Current (Ifsm): 2A; Max Surge Current: 2A; Packaging: Tape and Reel; Recovery Time: 4ns; Package Quantity: 3000; Voltage Rating (DC): 75V; Power Rating: 200mW; Current Rating: 150mA; Output Current: 150mA; Voltage: 75V; Max Reverse Voltage (DC): 75V; Current: 2A; Length: 1.8mm; Height: 1mm; Width: 1.4mm; Radiation Hardening: No; REACH SVHC: No SVHC; Lead Free: Lead Free; ComponentLink1URL: https://datasheet.ciiva.com/16199/ds30097-16199061.pdf; ComponentLink1Description: https://datasheet.ciiva.com/16199/ds30097-16199061.pdf; ComponentLink2URL: https://datasheet.ciiva.com/16472/ds30097-16472599.pdf; ComponentLink2Description: https://datasheet.ciiva.com/16472/ds30097-16472599.pdf; ComponentLink3URL: https://datasheet.ciiva.com/1179/ds30097-1179355.pdf; ComponentLink3Description: https://datasheet.ciiva.com/1179/ds30097-1179355.pdf; ComponentLink4URL: https://datasheet.ciiva.com/8300/ds30097-8300396.pdf; ComponentLink4Description: https://datasheet.ciiva.com/8300/ds30097-8300396.pdf; ComponentLink5URL: https://datasheet.ciiva.com/911/ds30097-911741.pdf; ComponentLink5Description: https://datasheet.ciiva.com/911/ds30097-911741.pdf; ComponentLink6URL: https://datasheet.ciiva.com/911/ds30097-911742.pdf; ComponentLink6Description: https://datasheet.ciiva.com/911/ds30097-911742.pdf; ComponentLink7URL: https://datasheet.ciiva.com/25946/ds30097-25946926.pdf; ComponentLink7Description: https://datasheet.ciiva.com/25946/ds30097-25946926.pdf; ComponentLink8URL: https://datasheet.ciiva.com/911/ds30097-911743.pdf; ComponentLink8Description: https://datasheet.ciiva.com/911/ds30097-911743.pdf; Supplier Part Number 1: 1N4148WS-FDICT-ND
P1 = F51L-1A7H1-11024: FLEX CONNECTOR, 1.00MM PITCH, HE; Manufacturer 1: Amphenol ICC / FCI; Supplier 1: Digi-Key; Manufacturer Part Number 1: F51L-1A7H1-11024; Category: FFC / FPC; Stock 1: 1646; Pricing 1: 1=0.77000, 10=0.67500, 25=0.61680, 50=0.58060, 100=0.55640, 250=0.50804, 500=0.48384 (USD); Supplier Part Number 1: 609-F51L-1A7H1-11024CT-ND
Q1 = 2N7002: MOSFET N-CH 60V 115MA SOT-23; Manufacturer 1: ON Semiconductor / Fairchild; Max Power Dissipation: 200mW; Drain to Source Resistance: 1.2R; Gate to Source Voltage (Vgs): 20V; Nominal Vgs: 2.1V; Number of Elements: 1; Element Configuration: Single; Input Capacitance: 50pF; Rds On Max: 7.5R; On-State Resistance: 5.3R; Supplier 1: Digi-Key; Manufacturer Part Number 1: 2N7002; Stock 1: 111118; Pricing 1: 1=0.33, 10=0.304, 100=0.17, 500=0.09108, 1000=0.06193 (USD); Mount: Surface Mount; Case/Package: SOT-23; Number of Pins: 3; Contact Plating: Tin,Matte; Min Operating Temperature: -55°C; Max Operating Temperature: 150°C; Continuous Drain Current (ID): 115mA; Packaging: Tape and Reel; Package Quantity: 1; Drain to Source Voltage (Vdss): 60V; Drain to Source Breakdown Voltage: 60V; Power Dissipation: 200mW; Threshold Voltage: 2.1V; Voltage Rating (DC): 60V; Current Rating: 115mA; Dual Supply Voltage: 60V; Current: 115mA; Voltage: 60V; Length: 2.92mm; Height: 0.93mm; Width: 3.05mm; Radiation Hardening: No; REACH SVHC: No SVHC; Lead Free: Lead Free; ComponentLink1URL: https://datasheet.ciiva.com/931/2n7000-931777.pdf; ComponentLink1Description: https://datasheet.ciiva.com/931/2n7000-931777.pdf; ComponentLink2URL: https://datasheet.ciiva.com/27746/47-0120-27746881.pdf; ComponentLink2Description: https://datasheet.ciiva.com/27746/47-0120-27746881.pdf; ComponentLink3URL: https://datasheet.ciiva.com/1254/2n7002-1254451.pdf; ComponentLink3Description: https://datasheet.ciiva.com/1254/2n7002-1254451.pdf; ComponentLink4URL: https://datasheet.ciiva.com/15137/getdatasheetpartid-93547-15137771.pdf; ComponentLink4Description: https://datasheet.ciiva.com/15137/getdatasheetpartid-93547-15137771.pdf; ComponentLink5URL: https://datasheet.ciiva.com/931/2n7000-931762.pdf; ComponentLink5Description: https://datasheet.ciiva.com/931/2n7000-931762.pdf; ComponentLink6URL: https://datasheet.ciiva.com/931/2n7000-931763.pdf; ComponentLink6Description: https://datasheet.ciiva.com/931/2n7000-931763.pdf; ComponentLink7URL: https://datasheet.ciiva.com/931/2n7000-931764.pdf; ComponentLink7Description: https://datasheet.ciiva.com/931/2n7000-931764.pdf; ComponentLink8URL: https://datasheet.ciiva.com/1254/660093-1254452.pdf; ComponentLink8Description: https://datasheet.ciiva.com/1254/660093-1254452.pdf; ComponentLink9URL: https://datasheet.ciiva.com/1188/660093-1188359.pdf; ComponentLink9Description: https://datasheet.ciiva.com/1188/660093-1188359.pdf; ComponentLink10URL: https://datasheet.ciiva.com/1188/660093-1188361.pdf; ComponentLink10Description: https://datasheet.ciiva.com/1188/660093-1188361.pdf; ComponentLink11URL: https://datasheet.ciiva.com/17007/2n7002-17007243.pdf; ComponentLink11Description: https://datasheet.ciiva.com/17007/2n7002-17007243.pdf; ComponentLink12URL: https://datasheet.ciiva.com/3304/nds7002a-3304380.pdf; ComponentLink12Description: https://datasheet.ciiva.com/3304/nds7002a-3304380.pdf; ComponentLink13URL: https://datasheet.ciiva.com/3304/nds7002a-3304381.pdf; ComponentLink13Description: https://datasheet.ciiva.com/3304/nds7002a-3304381.pdf; ComponentLink14URL: https://datasheet.ciiva.com/22655/660093-22655230.pdf; ComponentLink14Description: https://datasheet.ciiva.com/22655/660093-22655230.pdf; Supplier Part Number 1: 2N7002NCT-ND
R1 = RMCF0603JT160K: RES SMD 160K OHM 5% 1/10W 0603; Manufacturer 1: Stackpole Electronics; Resistance: 160kR; Power Rating: 100mW; Temperature Coefficient: 100ppm/°C; Supplier 1: Digi-Key; Manufacturer Part Number 1: RMCF0603JT160K; Stock 1: 10640; Pricing 1: 1=0.1, 10=0.016, 100=0.0064, 1000=0.00289, 2500=0.0025 (USD); Mount: Surface Mount; Case/Package: 0603; Case Code (Metric): 1608; Case Code (Imperial): 0603; Contact Plating: Tin,Matte; Min Operating Temperature: -55°C; Max Operating Temperature: 155°C; Tolerance: 5%; Packaging: Tape and Reel; Composition: Thick Film; Number of Terminations: 2; Max Power Dissipation: 100mW; Features: Automotive AEC-Q200; Length: 0.061inch; Height: 0.022inch; Width: 0.031inch; Radiation Hardening: No; Lead Free: Lead Free; Supplier Part Number 1: RMCF0603JT160KCT-ND
R2-R5 = AC0603JR-0710KL: RES SMD 10K OHM 5% 1/10W 0603; Manufacturer 1: Yageo; Voltage Rating: 50V; Resistance: 10kR; Power Rating: 100mW; Temperature Coefficient: 100ppm/°C; Supplier 1: Digi-Key; Manufacturer Part Number 1: AC0603JR-0710KL; Stock 1: 60451; Pricing 1: 1=0.1, 10=0.032, 100=0.0131, 1000=0.00588, 2500=0.0051 (USD); Case/Package: 0603; Case Code (Imperial): 0603; Case Code (Metric): 1608; Min Operating Temperature: -55°C; Max Operating Temperature: 155°C; Packaging: Tape and Reel; Tolerance: 5%; Package Quantity: 1; Composition: Thick Film; Termination: SMD/SMT; Number of Terminations: 2; Military Standard: Not; Max Power Dissipation: 100mW; Features: Moisture Resistant,Automotive AEC-Q200,Anti-Sulfur; Length: 0.063inch; Height: 0.022inch; Width: 0.031inch; Depth: 0.8mm; Lead Free: Lead Free; ComponentLink1URL: https://datasheet.ciiva.com/5562/pyu-ac-51-rohs-l-2-5562553.pdf; ComponentLink1Description: https://datasheet.ciiva.com/5562/pyu-ac-51-rohs-l-2-5562553.pdf; Supplier Part Number 1: 311-10KLECT-ND
R6-R8 = ESR03EZPJ104: RES SMD 100K OHM 5% 1/4W 0603; Manufacturer 1: Rohm; Resistance: 100kR; Power Rating: 200mW; Max Power Dissipation: 250mW; Temperature Coefficient: 200ppm/°C; Supplier 1: Digi-Key; Manufacturer Part Number 1: ESR03EZPJ104; Stock 1: 17901; Pricing 1: 1=0.1, 10=0.087, 100=0.0333, 1000=0.01464, 2500=0.01264 (USD); Case/Package: 0603; Case Code (Metric): 1608; Case Code (Imperial): 0603; Min Operating Temperature: -55°C; Max Operating Temperature: 155°C; Tolerance: 5%; Package Quantity: 1; Packaging: Cut Tape; Composition: Thick Film; Number of Terminations: 2; Length: 0.063inch; Height: 0.022inch; Width: 0.031inch; Lead Free: Lead Free; ComponentLink1URL: https://datasheet.ciiva.com/14930/esr-14930633.pdf; ComponentLink1Description: https://datasheet.ciiva.com/14930/esr-14930633.pdf; ComponentLink2URL: https://datasheet.ciiva.com/14924/esr-14924811.pdf; ComponentLink2Description: https://datasheet.ciiva.com/14924/esr-14924811.pdf; ComponentLink3URL: https://datasheet.ciiva.com/14928/esr-14928813.pdf; ComponentLink3Description: https://datasheet.ciiva.com/14928/esr-14928813.pdf; Supplier Part Number 1: RHM100KDCT-ND
U2 = LPC1778FBD144,551: IC MCU 32BIT 512KB FLASH 144LQFP; Manufacturer 1: NXP Semiconductors; Number of Timers/Counters: 4; Operating Supply Voltage: 3.3V; RAM Size: 96KB; Max Power Dissipation: 1.5W; Interface: I2C,SPI,USB,CAN,Ethernet,SSP,UART,USART,EBI/EMI,I2S; Number of I/Os: 109; Frequency: 120MHz; Max Supply Voltage: 3.6V; Min Supply Voltage: 2.4V; Number of PWM Channels: 6; Number of ADC Channels: 8; Number of Ethernet Channels: 1; Number of UART Channels: 5; Oscillator Type: Internal; Number of Programmable I/O: 165; Data Bus Width: 32b; Number of SPI Channels: 3; Watchdog Timer: Yes; Peripherals: Brown-out Detect/Reset,POR,PWM,WDT,DMA,I2C; Core Architecture: ARM; Supplier 1: Digi-Key; Manufacturer Part Number: LPC1778FBD144,551; Stock 1: 0; Pricing 1: 1=11.62000, 10=10.49800, 25=10.01000, 100=8.69170, 250=8.30112, 500=7.56866, 1000=6.59205 (USD); RoHS: Yes; Mount: Surface Mount; Case/Package: LQFP; Number of Pins: 144; Contact Plating: Tin; Min Operating Temperature: -40°C; Max Operating Temperature: 85°C; Packaging: Tray; Package Quantity: 60; Max Frequency: 120MHz; Number of I2C Channels: 3; Memory Type: FLASH; Memory Size: 512KB; Length: 20.1mm; Height: 1.45mm; Width: 20.1mm; Radiation Hardening: No; REACH SVHC: No SVHC; Lead Free: Lead Free; ComponentLink1URL: https://datasheet.ciiva.com/5700/1713929-5700204.pdf?src-supplier=Farnell; ComponentLink1Description: https://datasheet.ciiva.com/5700/1713929-5700204.pdf?src-supplier=Farnell; ComponentLink2URL: https://datasheet.ciiva.com/29721/lpc178x-7x-29721694.pdf?src-supplier=Digi-Key; ComponentLink2Description: https://datasheet.ciiva.com/29721/lpc178x-7x-29721694.pdf?src-supplier=Digi-Key; ComponentLink3URL: https://datasheet.ciiva.com/8010/1859465-8010171.pdf?src-supplier=Element14; ComponentLink3Description: https://datasheet.ciiva.com/8010/1859465-8010171.pdf?src-supplier=Element14; Supplier Part Number 1: 568-7571-ND
U3 = IC_MCP6001T-I/OT: IC OPAMP GP 1MHZ RRO SOT23-5; Manufacturer 1: Microchip; Voltage Gain: 112dB; Min Supply Voltage: 1.8V; Max Supply Voltage: 6V; Common Mode Rejection Ratio: 60dB; Operating Supply Voltage: 5.5V; Slew Rate: 0.6V/µs; Nominal Supply Current: 100uA; Number of Channels: 1; Output Current: 23mA; Input Bias Current: 1pA; Input Offset Voltage (Vos): 4.5mV; Power Supply Rejection Ratio (PSRR): 86dB; Supplier 1: Digi-Key; Manufacturer Part Number 1: MCP6001T-I/OT; Stock 1: 3412; Pricing 1: 1=0.25, 25=0.206 (USD); Mount: Surface Mount; Case/Package: SOT-23; Number of Pins: 5; Contact Plating: Tin,Matte; Min Operating Temperature: -40°C; Max Operating Temperature: 85°C; Gain Bandwidth Product: 1MHz; Packaging: Tape and Reel; Bandwidth: 1MHz; Unity Gain Bandwidth Product: 1MHz; Package Quantity: 1; Number of Circuits: 1; Operating Supply Current: 100uA; Output Current per Channel: 23mA; Number of Elements: 1; Number of Amplifiers: 1; Voltage: 6V; Length: 3.1mm; Height: 1.3mm; Width: 1.8mm; Radiation Hardening: No; REACH SVHC: No SVHC; Lead Free: Lead Free; ComponentLink1URL: https://datasheet.ciiva.com/1793/21733j-1793040.pdf; ComponentLink1Description: https://datasheet.ciiva.com/1793/21733j-1793040.pdf; ComponentLink2URL: https://datasheet.ciiva.com/16199/filehandler-aspxddocname-en011705-16199408.pdf; ComponentLink2Description: https://datasheet.ciiva.com/16199/filehandler-aspxddocname-en011705-16199408.pdf; ComponentLink3URL: https://datasheet.ciiva.com/26344/651487-da-01-en-ic-opamp-mcp6001t-i-ot-sot-23-5-mcp-26344500.pdf; ComponentLink3Description: https://datasheet.ciiva.com/26344/651487-da-01-en-ic-opamp-mcp6001t-i-ot-sot-23-5-mcp-26344500.pdf; ComponentLink4URL: https://datasheet.ciiva.com/1793/21733j-1793041.pdf; ComponentLink4Description: https://datasheet.ciiva.com/1793/21733j-1793041.pdf; ComponentLink5URL: https://datasheet.ciiva.com/1793/21733j-1793042.pdf; ComponentLink5Description: https://datasheet.ciiva.com/1793/21733j-1793042.pdf; ComponentLink6URL: https://datasheet.ciiva.com/16796/jp011705-16796421.pdf; ComponentLink6Description: https://datasheet.ciiva.com/16796/jp011705-16796421.pdf; ComponentLink7URL: https://datasheet.ciiva.com/8078/524878-8078826.pdf; ComponentLink7Description: https://datasheet.ciiva.com/8078/524878-8078826.pdf; ComponentLink8URL: https://datasheet.ciiva.com/14544/70045422-14544795.pdf; ComponentLink8Description: https://datasheet.ciiva.com/14544/70045422-14544795.pdf; ComponentLink9URL: https://datasheet.ciiva.com/8078/524878-8078829.pdf; ComponentLink9Description: https://datasheet.ciiva.com/8078/524878-8078829.pdf; ComponentLink10URL: https://datasheet.ciiva.com/14151/mcp6001-2-4-eng-tds-14151487.pdf; ComponentLink10Description: https://datasheet.ciiva.com/14151/mcp6001-2-4-eng-tds-14151487.pdf; Supplier Part Number 1: MCP6001T-I/OTCT-ND
Y1 = ECS-120-20-30B-AGL-TR: CRYSTAL 12MHZ 20PF SMD; Manufacturer 1: ECS International; Frequency Stability: 30ppm; Frequency Tolerance: 25ppm; ESR (Equivalent Series Resistance): 80R; Supplier 1: Digi-Key; Manufacturer Part Number: ECS-120-20-30B-AGL-TR; Stock 1: 1011; Pricing 1: 1=0.63000, 10=0.52300, 50=0.47020, 100=0.41800, 500=0.39710 (USD); RoHS: No; Mount: Surface Mount; Case/Package: SMD/SMT; Min Operating Temperature: -10°C; Max Operating Temperature: 70°C; Packaging: Cut Tape; Frequency: 12MHz; Load Capacitance: 20pF; ComponentLink1URL: http://www.ecsxtal.com/store/pdf/ecx_53b.pdf?src-supplier=Digi-Key; ComponentLink1Description: http://www.ecsxtal.com/store/pdf/ecx_53b.pdf?src-supplier=Digi-Key; Supplier Part Number 1: XC2731CT-ND

## Sheet [3]-GLCD_128X64.SchDoc: [3]-GLCD_128X64
size A3; DocumentNumber: 3; Revision: 01-01-2020; SheetNumber: 3; SheetTotal: 6
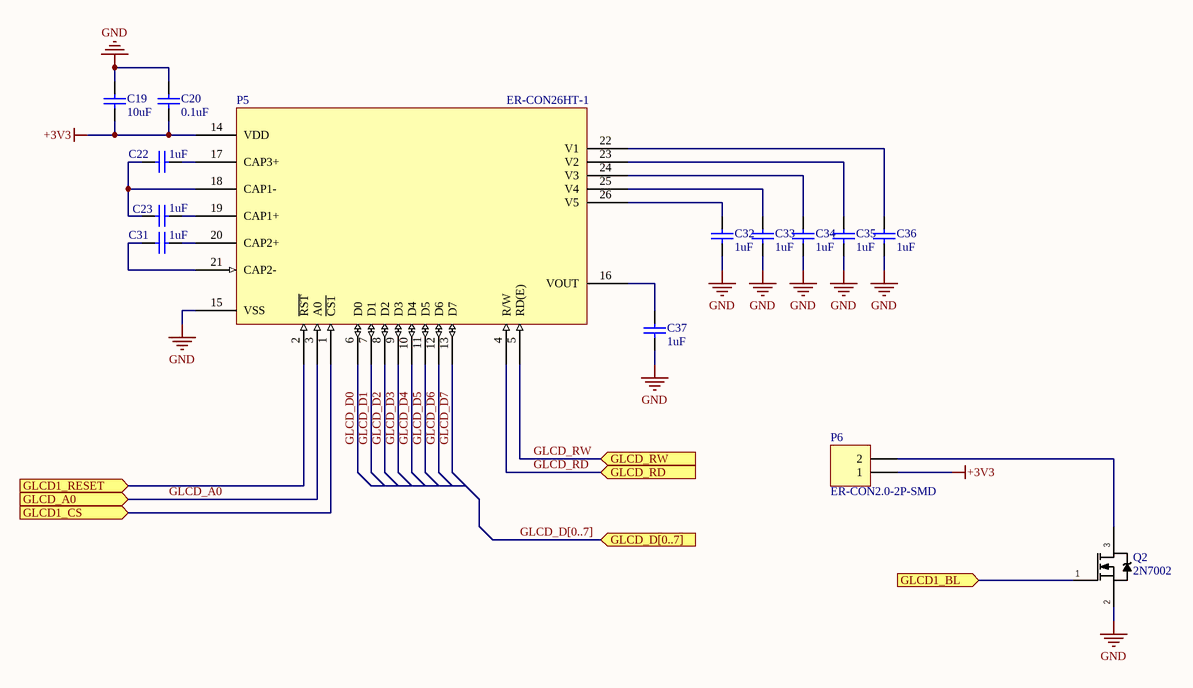
[diagram p2: [3]-GLCD_128X64.SchDoc]

### Parts
C19  10uF  [CAPC1608N]
C20  0.1uF  [CAPC1608N]
C22  1uF  [CAPC1608N]
C23  1uF  [CAPC1608N]
C31  1uF  [CAPC1608N]
C32  1uF  [CAPC1608N]
C33  1uF  [CAPC1608N]
C34  1uF  [CAPC1608N]
C35  1uF  [CAPC1608N]
C36  1uF  [CAPC1608N]
C37  1uF  [CAPC1608N]
P5  ER-CON26HT-1  [ER-CON26HT-1]
P6  ER-CON2.0-2P-SMD  [ER-CON2.0-2P-SMD]
Q2  2N7002  [SOT23-3N]

### Ports
GLCD1_BL (in), GLCD1_CS (in), GLCD1_RESET (in), GLCD_A0 (in), GLCD_D[0..7] (in), GLCD_RD (in), GLCD_RW (in)

### Nets
+3V3: C19.1 C20.1 P5.14(VDD) P6.1
GND: C19.2 C20.2 C32.1 C33.1 C34.1 C35.1 C36.1 C37.1 P5.15(VSS) Q2.2(S)
GLCD1_BL: Q2.1(G) ; port GLCD1_BL
GLCD1_CS: P5.1(~{CS1}) ; port GLCD1_CS
GLCD1_RESET: P5.2(~{RST}) ; port GLCD1_RESET
GLCD_A0: P5.3(A0) ; port GLCD_A0
GLCD_D0: P5.6(D0)
GLCD_D1: P5.7(D1)
GLCD_D2: P5.8(D2)
GLCD_D3: P5.9(D3)
GLCD_D4: P5.10(D4)
GLCD_D5: P5.11(D5)
GLCD_D6: P5.12(D6)
GLCD_D7: P5.13(D7)
GLCD_RD: P5.4(R/W) ; port GLCD_RD
GLCD_RW: P5.5(RD(E)) ; port GLCD_RW
NetC22_1: C22.1 C23.1 P5.18(CAP1-)
NetC22_2: C22.2 P5.17(CAP3+)
NetC23_2: C23.2 P5.19(CAP1+)
NetC31_1: C31.1 P5.21(CAP2-)
NetC31_2: C31.2 P5.20(CAP2+)
NetC32_2: C32.2 P5.26(V5)
NetC33_2: C33.2 P5.25(V4)
NetC34_2: C34.2 P5.24(V3)
NetC35_2: C35.2 P5.23(V2)
NetC36_2: C36.2 P5.22(V1)
NetC37_2: C37.2 P5.16(VOUT)
NetP6_2: P6.2 Q2.3(D)

### Buses and harness runs
bus GLCD_D[0..7] = port GLCD_D[0..7]

### Library data of the parts
C19 = GRM188R61A106KE69D: as C13 on sheet [2]-MCU_LPC1778FBD144; Supplier 1: Digi-Key; Manufacturer Part Number 1: GRM188R61A106KE69D; Stock 1: 40000; Pricing 1: 1=0.22, 10=0.149, 100=0.0754, 500=0.05158, 1000=0.04563 (USD); Mount: Surface Mount; Case/Package: 0603; Case Code (Metric): 1608; Case Code (Imperial): 0603; Min Operating Temperature: -55°C; Max Operating Temperature: 85°C; Capacitance: 10uF; Packaging: Tape and Reel; Dielectric: X5R; Voltage Rating: 10V; Voltage: 10V; Voltage Rating (DC): 10V; Length: 1.6mm; Height: 0.8mm; Width: 0.031inch; Thickness: 0.037inch; Depth: 0.8mm; REACH SVHC: No SVHC; Lead Free: Lead Free; Supplier Part Number 1: 490-10474-1-ND
C20 = CC0603KRX7R8BB104: as C3 on sheet [1]-PWR_12VIN; Supplier 1: Digi-Key; Manufacturer Part Number 1: CC0603KRX7R8BB104; Stock 1: 40000; Pricing 1: 1=0.1, 10=0.074, 100=0.0329, 500=0.02352, 1000=0.01848 (USD); Mount: Surface Mount; Case/Package: 0603; Number of Pins: 2; Case Code (Imperial): 0603; Case Code (Metric): 1608; Min Operating Temperature: -55°C; Max Operating Temperature: 125°C; Dielectric: X7R; Voltage Rating: 25V; Packaging: Tape and Reel; Package Quantity: 1; Voltage Rating (DC): 25V; Termination: SMD/SMT; Composition: Ceramic; Voltage: 25V; Length: 1.6mm; Height: 0.8mm; Width: 0.8mm; Thickness: 0.035inch; Depth: 0.8mm; Radiation Hardening: No; REACH SVHC: Unknown; Lead Free: Lead Free; Halogen Free: Halogen Free; ComponentLink1URL: https://datasheet.ciiva.com/11786/0900766b80c10176-11786120.pdf; ComponentLink1Description: https://datasheet.ciiva.com/11786/0900766b80c10176-11786120.pdf; ComponentLink2URL: https://datasheet.ciiva.com/144/mlccorderingcode-144075.pdf; ComponentLink2Description: https://datasheet.ciiva.com/144/mlccorderingcode-144075.pdf; ComponentLink3URL: https://datasheet.ciiva.com/17434/upy-gphc-x7r-6-3v-to-50v-8-17434263.pdf; ComponentLink3Description: https://datasheet.ciiva.com/17434/upy-gphc-x7r-6-3v-to-50v-8-17434263.pdf; ComponentLink4URL: https://datasheet.ciiva.com/26829/getdatasheetpartid-403577-26829431.pdf; ComponentLink4Description: https://datasheet.ciiva.com/26829/getdatasheetpartid-403577-26829431.pdf; ComponentLink5URL: https://datasheet.ciiva.com/11587/upy-gphc-x7r-6-3v-to-50v-8-11587208.pdf; ComponentLink5Description: https://datasheet.ciiva.com/11587/upy-gphc-x7r-6-3v-to-50v-8-11587208.pdf; ComponentLink6URL: https://datasheet.ciiva.com/13389/upy-gphc-x7r-6-3v-to-50v-8-13389352.pdf; ComponentLink6Description: https://datasheet.ciiva.com/13389/upy-gphc-x7r-6-3v-to-50v-8-13389352.pdf; ComponentLink7URL: https://datasheet.ciiva.com/28450/1489800-28450584.pdf; ComponentLink7Description: https://datasheet.ciiva.com/28450/1489800-28450584.pdf; ComponentLink8URL: https://datasheet.ciiva.com/144/mlccorderingcode-144073.pdf; ComponentLink8Description: https://datasheet.ciiva.com/144/mlccorderingcode-144073.pdf; ComponentLink9URL: https://datasheet.ciiva.com/144/mlccorderingcode-144074.pdf; ComponentLink9Description: https://datasheet.ciiva.com/144/mlccorderingcode-144074.pdf; ComponentLink10URL: https://datasheet.ciiva.com/7978/1489800-7978155.pdf; ComponentLink10Description: https://datasheet.ciiva.com/7978/1489800-7978155.pdf; Supplier Part Number 1: 311-1341-1-ND
C22 C23 C31-C37 = CL10A105KL8NNNC: CAP CER 1UF 35V X5R 0603; Manufacturer 1: Samsung; Description 1: 1µF ±10% 35V X5R Ceramic Capacitor -55°C ~ 85°C Surface Mount, MLCC 0603 (1608 Metric) 0.063" L x 0.031" W (1.60mm x 0.80mm); Capacitance: 1 µF; Tolerance (%): ±10 %; Supplier 1: Digi-Key; Manufacturer Part Number 1: CL10A105KL8NNNC; Stock 1: 65224; Pricing 1: 1=0.16, 10=0.117, 100=0.055, 500=0.0386, 1000=0.0319 (USD); Case Size/Dimension: 0603; Dielectric: X5R; Rated Voltage: 35 V; ComponentLink1URL: https://datasheet.ciiva.com/25773/cl10a105kl8nnnc-25773809.pdf; ComponentLink1Description: https://datasheet.ciiva.com/25773/cl10a105kl8nnnc-25773809.pdf; ComponentLink2URL: https://datasheet.ciiva.com/16202/clseries-16202344.pdf; ComponentLink2Description: https://datasheet.ciiva.com/16202/clseries-16202344.pdf; Supplier Part Number 1: 1276-1861-1-ND
P5 = ER-CON26HT-1: CONN ZIF 26 TOP PIN SMT
P6 = ER-CON2.0-2P-SMD: CONN 2 POS SMD 2MM PITCH
Q2 = 2N7002: as Q1 on sheet [2]-MCU_LPC1778FBD144; Supplier 1: Digi-Key; Manufacturer Part Number 1: 2N7002; Stock 1: 111118; Pricing 1: 1=0.33, 10=0.304, 100=0.17, 500=0.09108, 1000=0.06193 (USD); Mount: Surface Mount; Case/Package: SOT-23; Number of Pins: 3; Contact Plating: Tin,Matte; Min Operating Temperature: -55°C; Max Operating Temperature: 150°C; Continuous Drain Current (ID): 115mA; Packaging: Tape and Reel; Package Quantity: 1; Drain to Source Voltage (Vdss): 60V; Drain to Source Breakdown Voltage: 60V; Power Dissipation: 200mW; Threshold Voltage: 2.1V; Voltage Rating (DC): 60V; Current Rating: 115mA; Dual Supply Voltage: 60V; Current: 115mA; Voltage: 60V; Length: 2.92mm; Height: 0.93mm; Width: 3.05mm; Radiation Hardening: No; REACH SVHC: No SVHC; Lead Free: Lead Free; ComponentLink1URL: https://datasheet.ciiva.com/931/2n7000-931777.pdf; ComponentLink1Description: https://datasheet.ciiva.com/931/2n7000-931777.pdf; ComponentLink2URL: https://datasheet.ciiva.com/27746/47-0120-27746881.pdf; ComponentLink2Description: https://datasheet.ciiva.com/27746/47-0120-27746881.pdf; ComponentLink3URL: https://datasheet.ciiva.com/1254/2n7002-1254451.pdf; ComponentLink3Description: https://datasheet.ciiva.com/1254/2n7002-1254451.pdf; ComponentLink4URL: https://datasheet.ciiva.com/15137/getdatasheetpartid-93547-15137771.pdf; ComponentLink4Description: https://datasheet.ciiva.com/15137/getdatasheetpartid-93547-15137771.pdf; ComponentLink5URL: https://datasheet.ciiva.com/931/2n7000-931762.pdf; ComponentLink5Description: https://datasheet.ciiva.com/931/2n7000-931762.pdf; ComponentLink6URL: https://datasheet.ciiva.com/931/2n7000-931763.pdf; ComponentLink6Description: https://datasheet.ciiva.com/931/2n7000-931763.pdf; ComponentLink7URL: https://datasheet.ciiva.com/931/2n7000-931764.pdf; ComponentLink7Description: https://datasheet.ciiva.com/931/2n7000-931764.pdf; ComponentLink8URL: https://datasheet.ciiva.com/1254/660093-1254452.pdf; ComponentLink8Description: https://datasheet.ciiva.com/1254/660093-1254452.pdf; ComponentLink9URL: https://datasheet.ciiva.com/1188/660093-1188359.pdf; ComponentLink9Description: https://datasheet.ciiva.com/1188/660093-1188359.pdf; ComponentLink10URL: https://datasheet.ciiva.com/1188/660093-1188361.pdf; ComponentLink10Description: https://datasheet.ciiva.com/1188/660093-1188361.pdf; ComponentLink11URL: https://datasheet.ciiva.com/17007/2n7002-17007243.pdf; ComponentLink11Description: https://datasheet.ciiva.com/17007/2n7002-17007243.pdf; ComponentLink12URL: https://datasheet.ciiva.com/3304/nds7002a-3304380.pdf; ComponentLink12Description: https://datasheet.ciiva.com/3304/nds7002a-3304380.pdf; ComponentLink13URL: https://datasheet.ciiva.com/3304/nds7002a-3304381.pdf; ComponentLink13Description: https://datasheet.ciiva.com/3304/nds7002a-3304381.pdf; ComponentLink14URL: https://datasheet.ciiva.com/22655/660093-22655230.pdf; ComponentLink14Description: https://datasheet.ciiva.com/22655/660093-22655230.pdf; Supplier Part Number 1: 2N7002NCT-ND